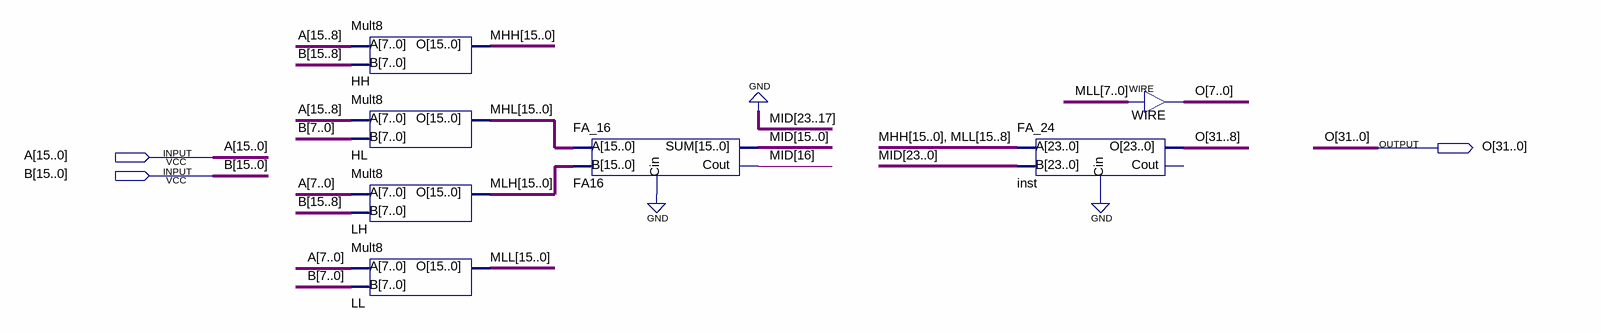
[diagram p0: schematic sheet]
// Quartus schematic Mult16bit.bdf as structural Verilog: 7 symbols, 3 pins
module Mult16bit (
  input  [15:0] A,
  input  [15:0] B,
  output [31:0] O
);

  wire [15:0] MHH, MHL, MLH, MLL;
  wire [16:0] MID;

  Mult8 HH (.A(A[15:8]), .B(B[15:8]), .O(MHH));
  Mult8 HL (.A(A[15:8]), .B(B[7:0]), .O(MHL));
  Mult8 LH (.A(A[7:0]), .B(B[15:8]), .O(MLH));
  Mult8 LL (.A(A[7:0]), .B(B[7:0]), .O(MLL));
  FA_16 FA16 (.Cin(1'b0), .A(MHL), .B(MLH), .SUM(MID[15:0]), .Cout(MID[16]));
  FA_24 inst (.A({MHH, MLL[15:8]}), .B({{7{1'b0}}, MID}), .Cin(1'b0), .O(O[31:8]));  // open: Cout
  assign O[7:0] = MLL[7:0];  // WIRE WIRE
endmodule
